# EAGLE schematic logger (EAGLE 7.2.0)
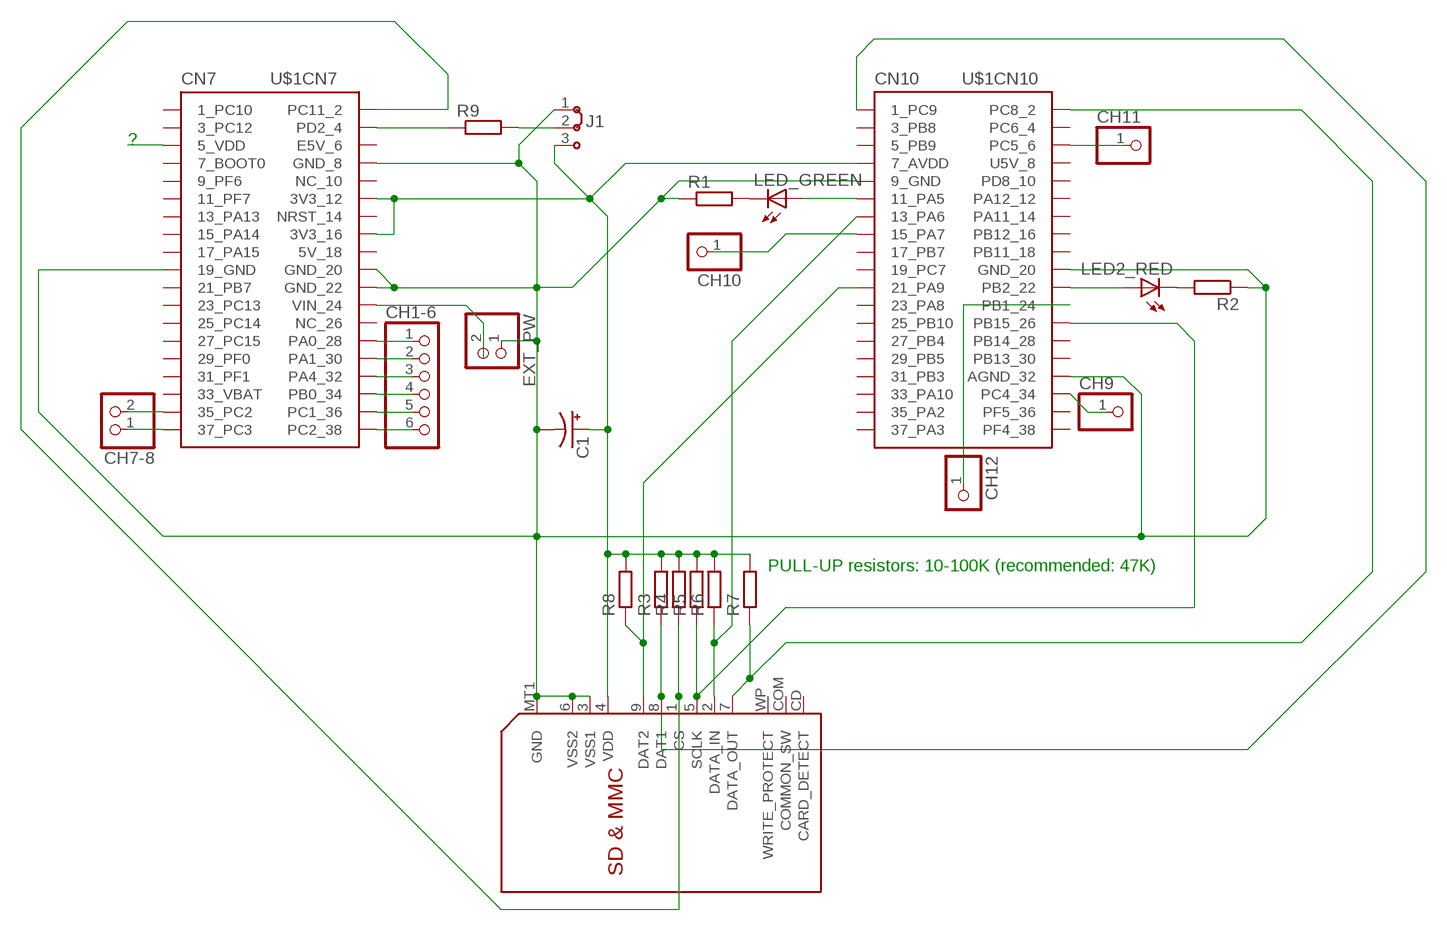
[diagram p0: schematic, sheet 1]

## Parts
C1  CPOL-USE5-10.5  [E5-10,5]
CH1-6  PINHD-1X6B  [1X06-BIG]
CH7-8  PINHD-1X2  [1X02]
CH9  PINHD-1X1  [1X01]
CH10  PINHD-1X1  [1X01]
CH11  PINHD-1X1  [1X01]
CH12  PINHD-1X1  [1X01]
EXT_PW  PINHD-1X2  [1X02]
J1  J2X2MM  [04C]
LED2_RED  LED  [SMARTLED-TTW]
LED_GREEN  LED  [SMARTLED-TTW]
R1  R-EU_M3216  [M3216]
R2  R-EU_M3216  [M3216]
R3  R-EU_M3216  [M3216]
R4  R-EU_M3216  [M3216]
R5  R-EU_M3216  [M3216]
R6  R-EU_M3216  [M3216]
R7  R-EU_M3216  [M3216]
R8  R-EU_M3216  [M3216]
R9  R-EU_M3216  [M3216]
U$1  NUCLEO-SHIELD-FULLSIZE  [NUCLEO-SHIELD-WITHHOLES-FULLSIZE]
U$2  SDMMC18650  [SDCARD]

## Nets
GND: C1.- EXT_PW.1 J1.1 R1.1 R2.1 U$1.CN7_8(CN7:GND_8) U$1.CN7_19(CN7:19_GND) U$1.CN7_20(CN7:GND_20) U$1.CN7_22(CN7:GND_22) U$1.CN10_9(CN10:9_GND) U$1.CN10_20(CN10:GND_20) U$1.CN10_32(CN10:AGND_32) U$2.3(VSS1) U$2.6(VSS2) U$2.MT1(GND)
N$1: LED_GREEN.C@1(C) R1.2
N$2: LED2_RED.C@1(C) R2.2
N$3: R7.1 U$1.CN10_2(CN10:PC8_2) U$2.7(DATA_OUT)
N$4: U$1.CN7_24(CN7:VIN_24)
N$5: LED_GREEN.A@1(A) U$1.CN10_11(CN10:11_PA5)
N$6: LED2_RED.A@1(A) U$1.CN10_22(CN10:PB2_22)
N$7: R8.1 U$1.CN10_21(CN10:21_PA9) U$2.9(DAT2)
N$8: R4.1 U$1.CN7_2(CN7:PC11_2) U$2.1(CS)
N$9: R6.1 U$1.CN10_13(CN10:13_PA6) U$2.2(DATA_IN)
N$10: U$1.CN7_5(CN7:5_VDD)
N$11: R5.1 U$1.CN10_26(CN10:PB15_26) U$2.5(SCLK)
N$12: U$1.CN10_1(CN10:1_PC9)
N$13: CH1-6.1 U$1.CN7_28(CN7:PA0_28)
N$14: CH1-6.2 U$1.CN7_30(CN7:PA1_30)
N$15: CH1-6.3 U$1.CN7_32(CN7:PA4_32)
N$16: CH1-6.4 U$1.CN7_34(CN7:PB0_34)
N$17: CH1-6.5 U$1.CN7_36(CN7:PC1_36)
N$18: CH1-6.6 U$1.CN7_38(CN7:PC2_38)
N$19: CH9.1 U$1.CN10_34(CN10:PC4_34)
N$20: CH7-8.2 U$1.CN7_35(CN7:35_PC2)
N$21: CH7-8.1 U$1.CN7_37(CN7:37_PC3)
N$22: CH10.1 U$1.CN10_15(CN10:15_PA7)
N$23: CH11.1 U$1.CN10_6(CN10:PC5_6)
N$24: CH12.1 U$1.CN10_24(CN10:PB1_24)
N$25: R3.1 U$2.8(DAT1)
N$26: R9.1 U$1.CN7_4(CN7:PD2_4)
N$27: J1.2 R9.2
VDD: C1.+ J1.3 R3.2 R4.2 R5.2 R6.2 R7.2 R8.2 U$1.CN7_12(CN7:3V3_12) U$1.CN7_16(CN7:3V3_16) U$1.CN10_7(CN10:7_AVDD) U$2.4(VDD)
Unconnected: EXT_PW.2 U$1.CN7_1(CN7:1_PC10) U$1.CN7_3(CN7:3_PC12) U$1.CN7_6(CN7:E5V_6) U$1.CN7_7(CN7:7_BOOT0) U$1.CN7_9(CN7:9_PF6) U$1.CN7_10(CN7:NC_10) U$1.CN7_11(CN7:11_PF7) U$1.CN7_13(CN7:13_PA13) U$1.CN7_14(CN7:NRST_14) U$1.CN7_15(CN7:15_PA14) U$1.CN7_17(CN7:17_PA15) U$1.CN7_18(CN7:5V_18) U$1.CN7_21(CN7:21_PB7) U$1.CN7_23(CN7:23_PC13) U$1.CN7_25(CN7:25_PC14) U$1.CN7_26(CN7:NC_26) U$1.CN7_27(CN7:27_PC15) U$1.CN7_29(CN7:29_PF0) U$1.CN7_31(CN7:31_PF1) U$1.CN7_33(CN7:33_VBAT) U$1.CN10_3(CN10:3_PB8) U$1.CN10_4(CN10:PC6_4) U$1.CN10_5(CN10:5_PB9) U$1.CN10_8(CN10:U5V_8) U$1.CN10_10(CN10:PD8_10) U$1.CN10_12(CN10:PA12_12) U$1.CN10_14(CN10:PA11_14) U$1.CN10_16(CN10:PB12_16) U$1.CN10_17(CN10:17_PB7) U$1.CN10_18(CN10:PB11_18) U$1.CN10_19(CN10:19_PC7) U$1.CN10_23(CN10:23_PA8) U$1.CN10_25(CN10:25_PB10) U$1.CN10_27(CN10:27_PB4) U$1.CN10_28(CN10:PB14_28) U$1.CN10_29(CN10:29_PB5) U$1.CN10_30(CN10:PB13_30) U$1.CN10_31(CN10:31_PB3) U$1.CN10_33(CN10:33_PA10) U$1.CN10_35(CN10:35_PA2) U$1.CN10_36(CN10:PF5_36) U$1.CN10_37(CN10:37_PA3) U$1.CN10_38(CN10:PF4_38) U$2.CD(CARD_DETECT) U$2.COM(COMMON_SW) U$2.WP(WRITE_PROTECT)

## Notes on the sheet
- ?
- PULL-UP resistors: 10-100K (recommended: 47K)

## Library data of the parts
C1 = resistor:CPOL-US: POLARIZED CAPACITOR, American symbol
CH1-6 = adafruit:PINHD-1X6: PIN HEADER
CH7-8 EXT_PW = pinhead:PINHD-1X2: PIN HEADER
CH9-CH12 = adafruit:PINHD-1X1: Pin header 1x1 for 0.1" spacing With round pins
J1 = jumper:J2: Jumper switch 2 x 2.5 mm
LED2_RED LED_GREEN = led:LED: LED OSRAM: - CHIPLED LG R971, LG N971, LY N971, LG Q971, LY Q971, LO R971, LY R971 LH N974, LH R974 LS Q976, LO Q976, LY Q976 LO Q996 - Hyper CHIPLED LW Q18S LB Q993, LB Q99A, LB R99A - SideLED LS A670, LO A670, LY A670, LG A670, LP A670 LB A673, LV A673, LT A673, LW A673 LH A674 LY A675 LS A676, LA A676, LO A676, LY A676, LW A676 LS A679, LY A679, LG A679 - Hyper Micro SIDELED® LS Y876, LA Y876, LO Y876, LY Y876 LT Y87S - SmartLED LW L88C, LW L88S LB L89C, LB L89S, LG L890 LS L89K, LO L89K, LY L89K LS L896, LA L896, LO L896, LY L896 - TOPLED LS T670, LO T670, LY T670, LG T670, LP T670 LSG T670, LSP T670, LSY T670, LOP T670, LYG T670 LG T671, LOG T671, LSG T671 LB T673, LV T673, LT T673, LW T673 LH T674 LS T676, LA T676, LO T676, LY T676, LB T676, LH T676, LSB T676, LW T676 LB T67C, LV T67C, LT T67C, LS T67K, LO T67K, LY T67K, LW E67C LS E67B, LA E67B, LO E67B, LY E67B, LB E67C, LV E67C, LT E67C LW T67C LS T679, LY T679, LG T679 LS T770, LO T770, LY T770, LG T770, LP T770 LB T773, LV T773, LT T773, LW T773 LH T774 LS E675, LA E675, LY E675, LS T675 LS T776, LA T776, LO T776, LY T776, LB T776 LHGB T686 LT T68C, LB T68C - Hyper Mini TOPLED® LB M676 - Mini TOPLED Santana® LG M470 LS M47K, LO M47K, LY M47K Source: http://www.osram.convergy.de LUXEON: - LUMILED® LXK2-PW12-R00, LXK2-PW12-S00, LXK2-PW14-U00, LXK2-PW14-V00 LXK2-PM12-R00, LXK2-PM12-S00, LXK2-PM14-U00 LXK2-PE12-Q00, LXK2-PE12-R00, LXK2-PE12-S00, LXK2-PE14-T00, LXK2-PE14-U00 LXK2-PB12-K00, LXK2-PB12-L00, LXK2-PB12-M00, LXK2-PB14-N00, LXK2-PB14-P00, LXK2-PB14-Q00 LXK2-PR12-L00, LXK2-PR12-M00, LXK2-PR14-Q00, LXK2-PR14-R00 LXK2-PD12-Q00, LXK2-PD12-R00, LXK2-PD12-S00 LXK2-PH12-R00, LXK2-PH12-S00 LXK2-PL12-P00, LXK2-PL12-Q00, LXK2-PL12-R00 Source: www.luxeon.com KINGBRIGHT: KA-3528ASYC Source: www.kingbright.com
R1-R9 = resistor:R-EU_: RESISTOR, European symbol
U$1 = ELL-i-Boards:NUCLEO-SHIELD
U$2 = adafruit:SDMMC: SD MMC Card holder 4UCON part #06132 - easy to solder